# Altium schematic sheet USB Device.SchDoc: USB Device
size A4; SheetSize: A4
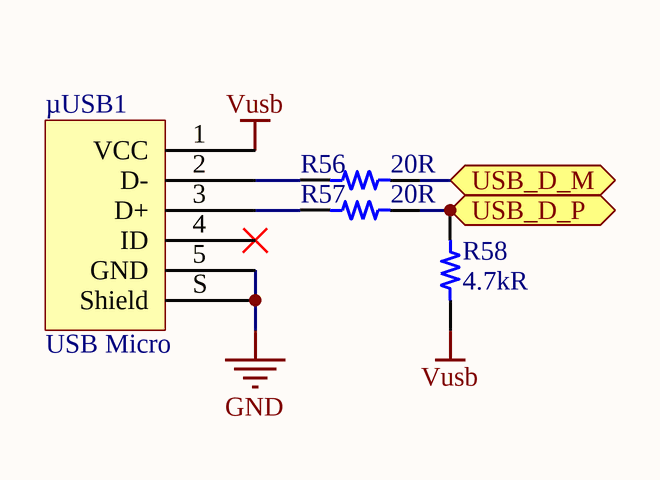
[diagram p0: USB Device.SchDoc]

## Parts
R56  20R  [RES 0603/1608]
R57  20R  [RES 0603/1608]
R58  4.7kR  [RES 0603/1608]
µUSB1  USB Micro  [FCI USB 10118193-0001LF]

## Ports
USB_D_M (bidir), USB_D_P (bidir)

## Nets
GND: µUSB1.5(GND) µUSB1.S(Shield)
Vusb: R58.1 µUSB1.1(VCC)
USB_D_M: R56.1 ; port USB_D_M
USB_D_P: R57.1 R58.2 ; port USB_D_P
NetR56_2: R56.2 µUSB1.2(D-)
NetR57_2: R57.2 µUSB1.3(D+)

Not connected (* = marked no-connect by the designer): µUSB1 4(ID)*

## Notes on the sheet
- Title:
- Size:
- Project:
- Revision:
- Sheet
- of
- Date:
- YıLDıZ IoT
- Elperek Mahallesi
- Saray Sokak, No:12
- SAKARYA / TURKEY
- File:

## Library data of the parts
R56 R57 = Resistor_Chip: Ceramic, SMT Capacitor; Manufacturer: Panasonic; Manufacturer Part Number: ERJ3EKF20R0V; Power Rating: 100mW; Tolerance: 1%; Voltage Rating: 75V; Temperature Coefficient: 100ppm/°C; Voltage Rating (DC): 50V; Supplier 1: Digi-Key; Supplier Part Number 1: P20.0HCT-ND; Stock 1: 1013618; Pricing 1: 1 = 0,10000, 10 = 0,06500, 100 = 0,02640, 1000 = 0,01186, 2500 = 0,01029 (USD); RoHS: Yes; Mount: Surface Mount; Case/Package: 0603; Case Code (Metric): 1608; Case Code (Imperial): 0603; Contact Plating: Tin; Min Operating Temperature: -55°C; Max Operating Temperature: 155°C; Packaging: Tape and Reel; Resistance: 20R; Package Quantity: 1; Composition: Thick Film; Number of Terminations: 2; Termination: SMD/SMT; Military Standard: Not; Max Power Dissipation: 100mW; Features: Automotive AEC-Q200; Length: 1.6mm; Height: 0.45mm; Width: 0.031inch; Depth: 0.8mm; Radiation Hardening: No; REACH SVHC: No SVHC; Lead Free: Lead Free; ComponentLink1URL: http://industrial.panasonic.com/www-data/pdf/AOA0000/AOA0000CE2.pdf; ComponentLink1Description: http://industrial.panasonic.com/www-data/pdf/AOA0000/AOA0000CE2.pdf; ComponentLink2URL: https://www.alliedelec.com/m/d/623f45ff1957d936ff56d46fd1c28cac.pdf; ComponentLink2Description: https://www.alliedelec.com/m/d/623f45ff1957d936ff56d46fd1c28cac.pdf; ComponentLink3URL: http://www.jameco.com/Jameco/Products/ProdDS/1987732.pdf; ComponentLink3Description: http://www.jameco.com/Jameco/Products/ProdDS/1987732.pdf; ComponentLink4URL: http://www.farnell.com/datasheets/1678782.pdf; ComponentLink4Description: http://www.farnell.com/datasheets/1678782.pdf; ComponentLink5URL: http://www.farnell.com/datasheets/1911175.pdf; ComponentLink5Description: http://www.farnell.com/datasheets/1911175.pdf; ComponentLink6URL: http://www.mouser.com/ds/2/315/AOA0000CE2-37512.pdf; ComponentLink6Description: http://www.mouser.com/ds/2/315/AOA0000CE2-37512.pdf
R58 = Resistor_Chip: Ceramic, SMT Capacitor; Manufacturer: Yageo Phycomp; Manufacturer Part Number: RC0603FR-074K7L; Tolerance: 1%; Temperature Coefficient: 100ppm/°C; Voltage Rating (DC): 50V; Power Rating: 100mW; Supplier 1: Digi-Key; Supplier Part Number 1: 311-4.70KHRCT-ND; Stock 1: 21621510; Pricing 1: 1 = 0,10000, 10 = 0,02400, 100 = 0,00970, 1000 = 0,00437, 2500 = 0,00379 (USD); RoHS: Yes; Mount: Surface Mount; Case/Package: 0603; Number of Pins: 2; Min Operating Temperature: -55°C; Max Operating Temperature: 155°C; Packaging: Cut Tape; Resistance: 4.7kR; Length: 1.6mm; Height: 0.45mm; Width: 800um; Depth: 0.8mm; REACH SVHC: No SVHC; Lead Free: Lead Free
µUSB1 = USB 2.0 Type B Micro